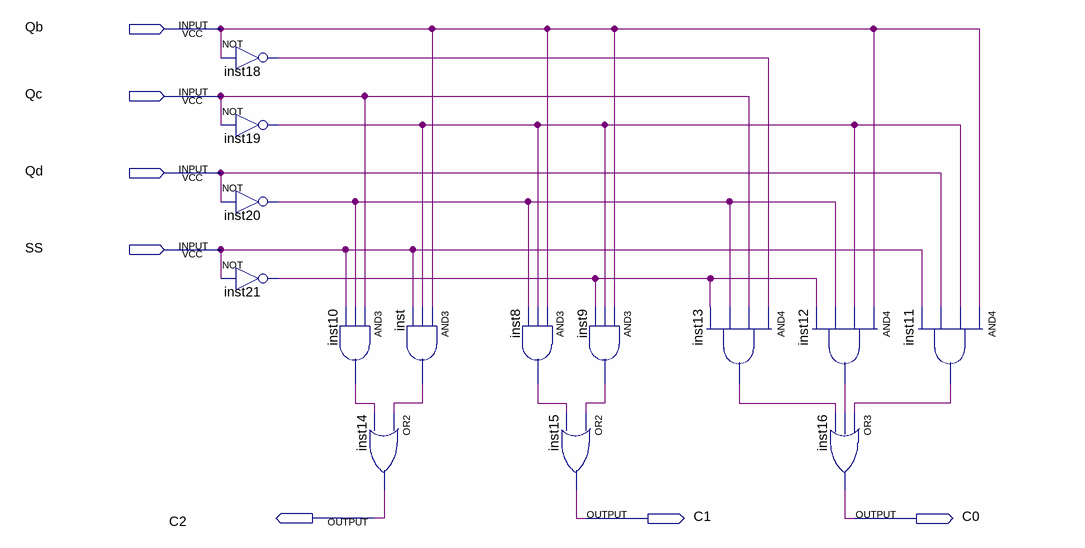
[diagram p0: schematic sheet]
// Quartus schematic SaidaPBL03.bdf as structural Verilog: 14 symbols, 7 pins
module SaidaPBL03 (
  input  Qb,
  input  Qc,
  input  Qd,
  input  SS,
  output C2,
  output C1,
  output C0
);

  wire inst8_out, inst9_out, inst10_out, inst11_out, inst12_out, inst13_out, inst18_out, inst19_out,
       inst20_out, inst21_out, inst_out;

  not inst18 (inst18_out, Qb);
  not inst19 (inst19_out, Qc);
  not inst20 (inst20_out, Qd);
  not inst21 (inst21_out, SS);
  and inst10 (inst10_out, Qc, inst20_out, SS);
  or inst14 (C2, inst_out, inst10_out);
  and inst (inst_out, Qb, inst19_out, SS);
  and inst8 (inst8_out, Qb, inst19_out, inst20_out);
  and inst9 (inst9_out, Qb, inst19_out, inst21_out);
  or inst15 (C1, inst9_out, inst8_out);
  and inst13 (inst13_out, inst18_out, Qc, inst20_out, inst21_out);
  and inst12 (inst12_out, Qb, inst19_out, inst20_out, inst21_out);
  or inst16 (C0, inst11_out, inst12_out, inst13_out);
  and inst11 (inst11_out, Qb, inst19_out, Qd, SS);
endmodule
